# Altium schematic sheet Main.SchDoc
size A4
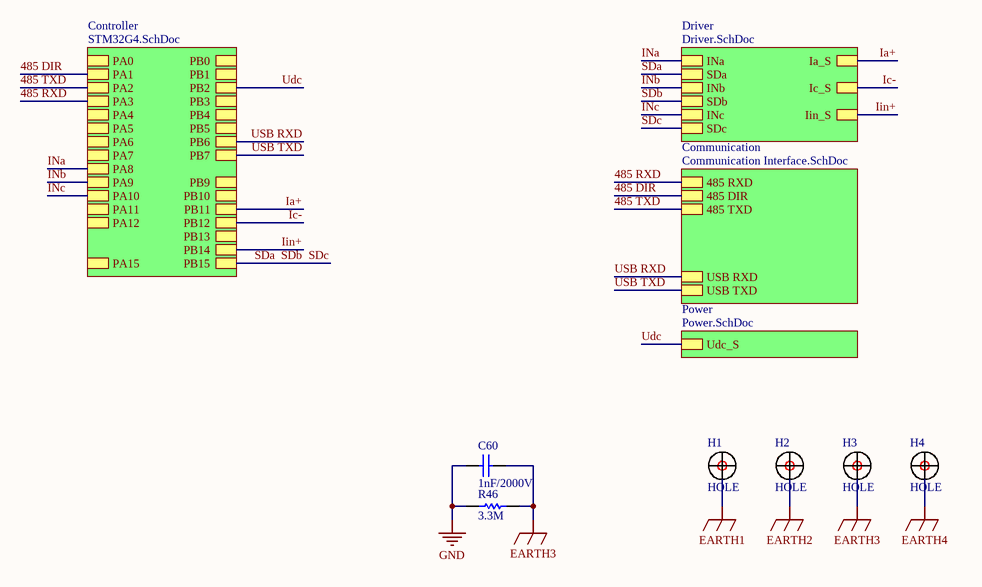
[diagram p0: Main.SchDoc]

## Parts
C60  1nF/2000V  [C1206]
H1  HOLE  [定位孔 Φ3 1]
H2  HOLE  [定位孔 Φ3 1]
H3  HOLE  [定位孔 Φ3 1]
H4  HOLE  [定位孔 Φ3 1]
R46  3.3M  [R1206]

## Sub-sheets
Communication = Communication Interface.SchDoc: 485 RXD, 485 DIR, 485 TXD, USB RXD, USB TXD
Controller = STM32G4.SchDoc: PA1, PA2, PA3, PA4, PA5, PA6, PA7, PA8, PA9, PA10, PA11, PA12, PA15, PB1, PB2, PB3, PB4, PB5, PB6, PB7, PB9, PB10, PB11, PB12, PB13, PB14, PB15, PA0, PB0
Driver = Driver.SchDoc: INa, SDa, Ia_S, Ic_S, INb, SDb, INc, SDc, Iin_S
Power = Power.SchDoc: Udc_S

## Nets
EARTH1: H1.1
EARTH2: H2.1
EARTH3: C60.2 H3.1 R46.1
EARTH4: H4.1
GND: C60.1 R46.2
485 DIR: sheet Controller/PA1, sheet Communication/485 DIR
485 RXD: sheet Controller/PA3, sheet Communication/485 RXD
485 TXD: sheet Controller/PA2, sheet Communication/485 TXD
Ia+: sheet Controller/PB11, sheet Driver/Ia_S
Ic-: sheet Controller/PB12, sheet Driver/Ic_S
Iin+: sheet Controller/PB14, sheet Driver/Iin_S
INa: sheet Controller/PA8, sheet Driver/INa
INb: sheet Controller/PA9, sheet Driver/INb
INc: sheet Controller/PA10, sheet Driver/INc
SDa: sheet Controller/PB15, sheet Driver/SDa, sheet Driver/SDb, sheet Driver/SDc  [also labelled SDb, SDc]
Udc: sheet Controller/PB2, sheet Power/Udc_S
USB RXD: sheet Controller/PB6, sheet Communication/USB RXD
USB TXD: sheet Controller/PB7, sheet Communication/USB TXD

## Library data of the parts
C60 = Cap
R46 = RES